# EAGLE design RECEPTRICE V16 (EAGLE 5.08)
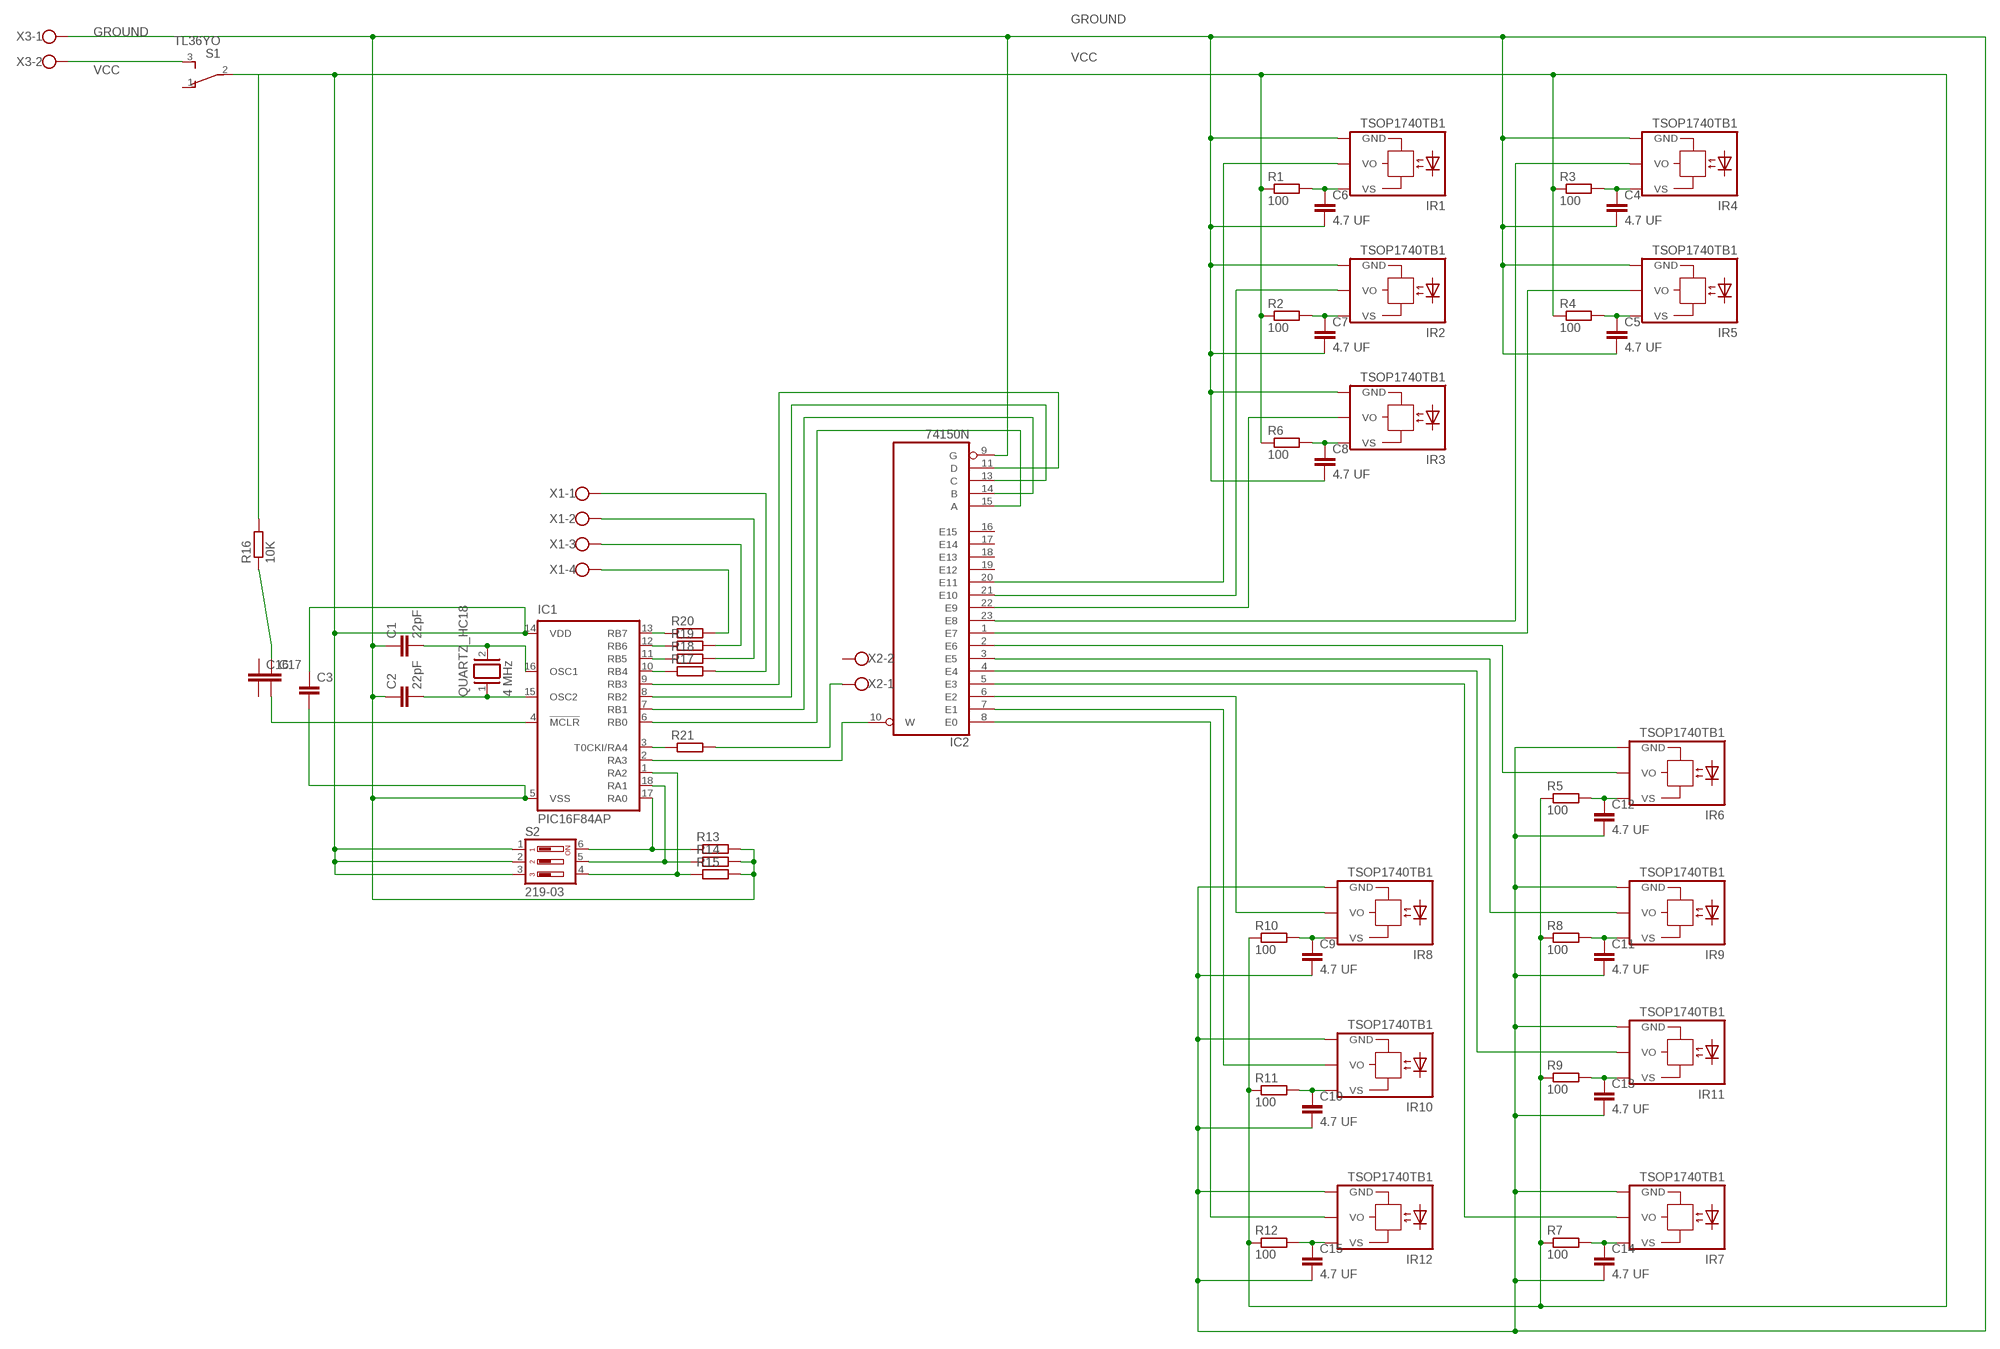
[diagram p0: schematic, sheet 1]

## Parts
C1  22pF  C2.5/5  [C2.5-5]
C2  22pF  C2.5/5  [C2.5-5]
C3  C2,5-3  [C2.5-3]
C4  4.7 UF  C5/3.5  [C5B3.5]
C5  4.7 UF  C5/3.5  [C5B3.5]
C6  4.7 UF  C5/3.5  [C5B3.5]
C7  4.7 UF  C5/3.5  [C5B3.5]
C8  4.7 UF  C5/3.5  [C5B3.5]
C9  4.7 UF  C5/3.5  [C5B3.5]
C10  4.7 UF  C5/3.5  [C5B3.5]
C11  4.7 UF  C5/3.5  [C5B3.5]
C12  4.7 UF  C5/3.5  [C5B3.5]
C13  4.7 UF  C5/3.5  [C5B3.5]
C14  4.7 UF  C5/3.5  [C5B3.5]
C15  4.7 UF  C5/3.5  [C5B3.5]
C16  C2,5-3  [C2.5-3]
C17  C2,5-3  [C2.5-3]
IC1  PIC16F84AP  [DIL18]
IC2  74150N  [DIL24-6]
IR1  TSOP1740TB1  [TSOP17_TB1]
IR2  TSOP1740TB1  [TSOP17_TB1]
IR3  TSOP1740TB1  [TSOP17_TB1]
IR4  TSOP1740TB1  [TSOP17_TB1]
IR5  TSOP1740TB1  [TSOP17_TB1]
IR6  TSOP1740TB1  [TSOP17_TB1]
IR7  TSOP1740TB1  [TSOP17_TB1]
IR8  TSOP1740TB1  [TSOP17_TB1]
IR9  TSOP1740TB1  [TSOP17_TB1]
IR10  TSOP1740TB1  [TSOP17_TB1]
IR11  TSOP1740TB1  [TSOP17_TB1]
IR12  TSOP1740TB1  [TSOP17_TB1]
QUARTZ_HC18  4 MHz  XTAL/S  [QS]
R1  100  R-EU_0207/5V  [0207/5V]
R2  100  R-EU_0207/5V  [0207/5V]
R3  100  R-EU_0207/5V  [0207/5V]
R4  100  R-EU_0207/5V  [0207/5V]
R5  100  R-EU_0207/5V  [0207/5V]
R6  100  R-EU_0207/5V  [0207/5V]
R7  100  R-EU_0207/5V  [0207/5V]
R8  100  R-EU_0207/5V  [0207/5V]
R9  100  R-EU_0207/5V  [0207/5V]
R10  100  R-EU_0207/5V  [0207/5V]
R11  100  R-EU_0207/5V  [0207/5V]
R12  100  R-EU_0207/5V  [0207/5V]
R13  R-EU_0207/5V  [0207/5V]
R14  R-EU_0207/5V  [0207/5V]
R15  R-EU_0207/5V  [0207/5V]
R16  10K  R-EU_0207/5V  [0207/5V]
R17  R-EU_0207/5V  [0207/5V]
R18  R-EU_0207/5V  [0207/5V]
R19  R-EU_0207/5V  [0207/5V]
R20  R-EU_0207/5V  [0207/5V]
R21  R-EU_0207/5V  [0207/5V]
S1  TL36YO  [TL3XYO]
S2  219-03  [CTS-219-03]
X1  W237-4  [W237-4]
X2  W237-102  [W237-102]
X3  W237-102  [W237-102]

## Nets
GROUND: C1.1 C2.1 C3.2 C4.2 C5.2 C6.2 C7.2 C8.2 C9.2 C10.2 C11.2 C12.2 C13.2 C14.2 C15.2 IC1.5(VSS) IC2.9(G) IR1.GND IR2.GND IR3.GND IR4.GND IR5.GND IR6.GND IR7.GND IR8.GND IR9.GND IR10.GND IR11.GND IR12.GND R13.2 R14.2 R15.2 X3.1
N$1: IC1.6(RB0) IC2.15(A)
N$2: IC1.7(RB1) IC2.14(B)
N$3: IC1.8(RB2) IC2.13(C)
N$4: IC1.9(RB3) IC2.11(D)
N$5: C6.1 IR1.VS R1.2
N$6: C4.1 IR4.VS R3.2
N$7: C7.1 IR2.VS R2.2
N$8: C5.1 IR5.VS R4.2
N$9: C12.1 IR6.VS R5.2
N$10: C8.1 IR3.VS R6.2
N$11: C14.1 IR7.VS R7.2
N$12: C9.1 IR8.VS R10.2
N$13: C11.1 IR9.VS R8.2
N$14: C13.1 IR11.VS R9.2
N$15: C10.1 IR10.VS R11.2
N$16: IC2.6(E2) IR8.VO
N$17: IC2.7(E1) IR10.VO
N$18: C15.1 IR12.VS R12.2
N$19: IC2.8(E0) IR12.VO
N$20: IC2.5(E3) IR7.VO
N$21: IC2.4(E4) IR11.VO
N$22: IC2.3(E5) IR9.VO
N$23: IC2.2(E6) IR6.VO
N$24: IC2.1(E7) IR5.VO
N$25: IC2.23(E8) IR4.VO
N$26: IC2.22(E9) IR3.VO
N$27: IC2.21(E10) IR2.VO
N$28: IC2.20(E11) IR1.VO
N$29: C2.2 IC1.15(OSC2) QUARTZ_HC18.1
N$30: C1.2 IC1.16(OSC1) QUARTZ_HC18.2
N$31: IC1.2(RA3) IC2.10(W)
N$32: C17.1 R16.1
N$33: IC1.17(RA0) R13.1 S2.6
N$34: IC1.18(RA1) R14.1 S2.5
N$36: IC1.1(RA2) R15.1 S2.4
N$37: C17.2 IC1.4(!MCLR)
N$38: S1.3(S) X3.2
N$39: R20.2 X1.4
N$40: IC1.13(RB7) R20.1
N$41: IC1.12(RB6) R19.1
N$42: IC1.11(RB5) R18.1
N$43: IC1.10(RB4) R17.1
N$44: R19.2 X1.3
N$45: R18.2 X1.2
N$46: R17.2 X1.1
N$48: IC1.3(T0CKI/RA4) R21.1
N$49: R21.2 X2.1
VCC: C3.1 IC1.14(VDD) R1.1 R2.1 R3.1 R4.1 R5.1 R6.1 R7.1 R8.1 R9.1 R10.1 R11.1 R12.1 R16.2 S1.2(P) S2.1 S2.2 S2.3
Unconnected: C16.1 C16.2 IC2.16(E15) IC2.17(E14) IC2.18(E13) IC2.19(E12) S1.1(O) X2.2

## Power pins joined to a net without a drawn wire
GND: IC2.12(GND)
VCC: IC2.24(VCC)

## Library data of the parts
C1-C17 = capacitor-wima:C: CAPACITOR naming: grid - package width
IC1 = microchip:PIC16F8*: MICROCONTROLLER 8-Bit PIC16F8X Family - CMOS Flash/EEPROM Pin Compatible : PIC16F83, PIC16CR83, PIC16F84A, PIC16CR84 see also PIC16C*
IC2 = 74xx-eu:74*150: Data SELCTOR/MULTIPLEXER
IR1-IR12 = telefunken:TSOP17*TB1: TSOP17..TB1 IR Receiver Modules for Remote Control Systems Source: http://www.vishay.com/docs/82042/82042.pdf
QUARTZ_HC18 = special:XTAL/S: CRYSTAL
R1-R21 = resistor:R-EU_: RESISTOR, European symbol
S1 = switch:TL36YO: TINY SWITCH ON - ON Source: http://www2.produktinfo.conrad.com/datenblaetter/700000-724999/705152-da-01-de-Subminiaturschalter_TL_36YO.pdf
S2 = switch-dil:219-03*: Surface Mount DIP Switch Series 219 SMT CTS Electronic Components Sourc: www.ctscorp.com
X1 = con-wago-500:W237-4: WAGO SCREW CLAMP
X2 X3 = con-wago-500:W237-102: WAGO SCREW CLAMP

## Board
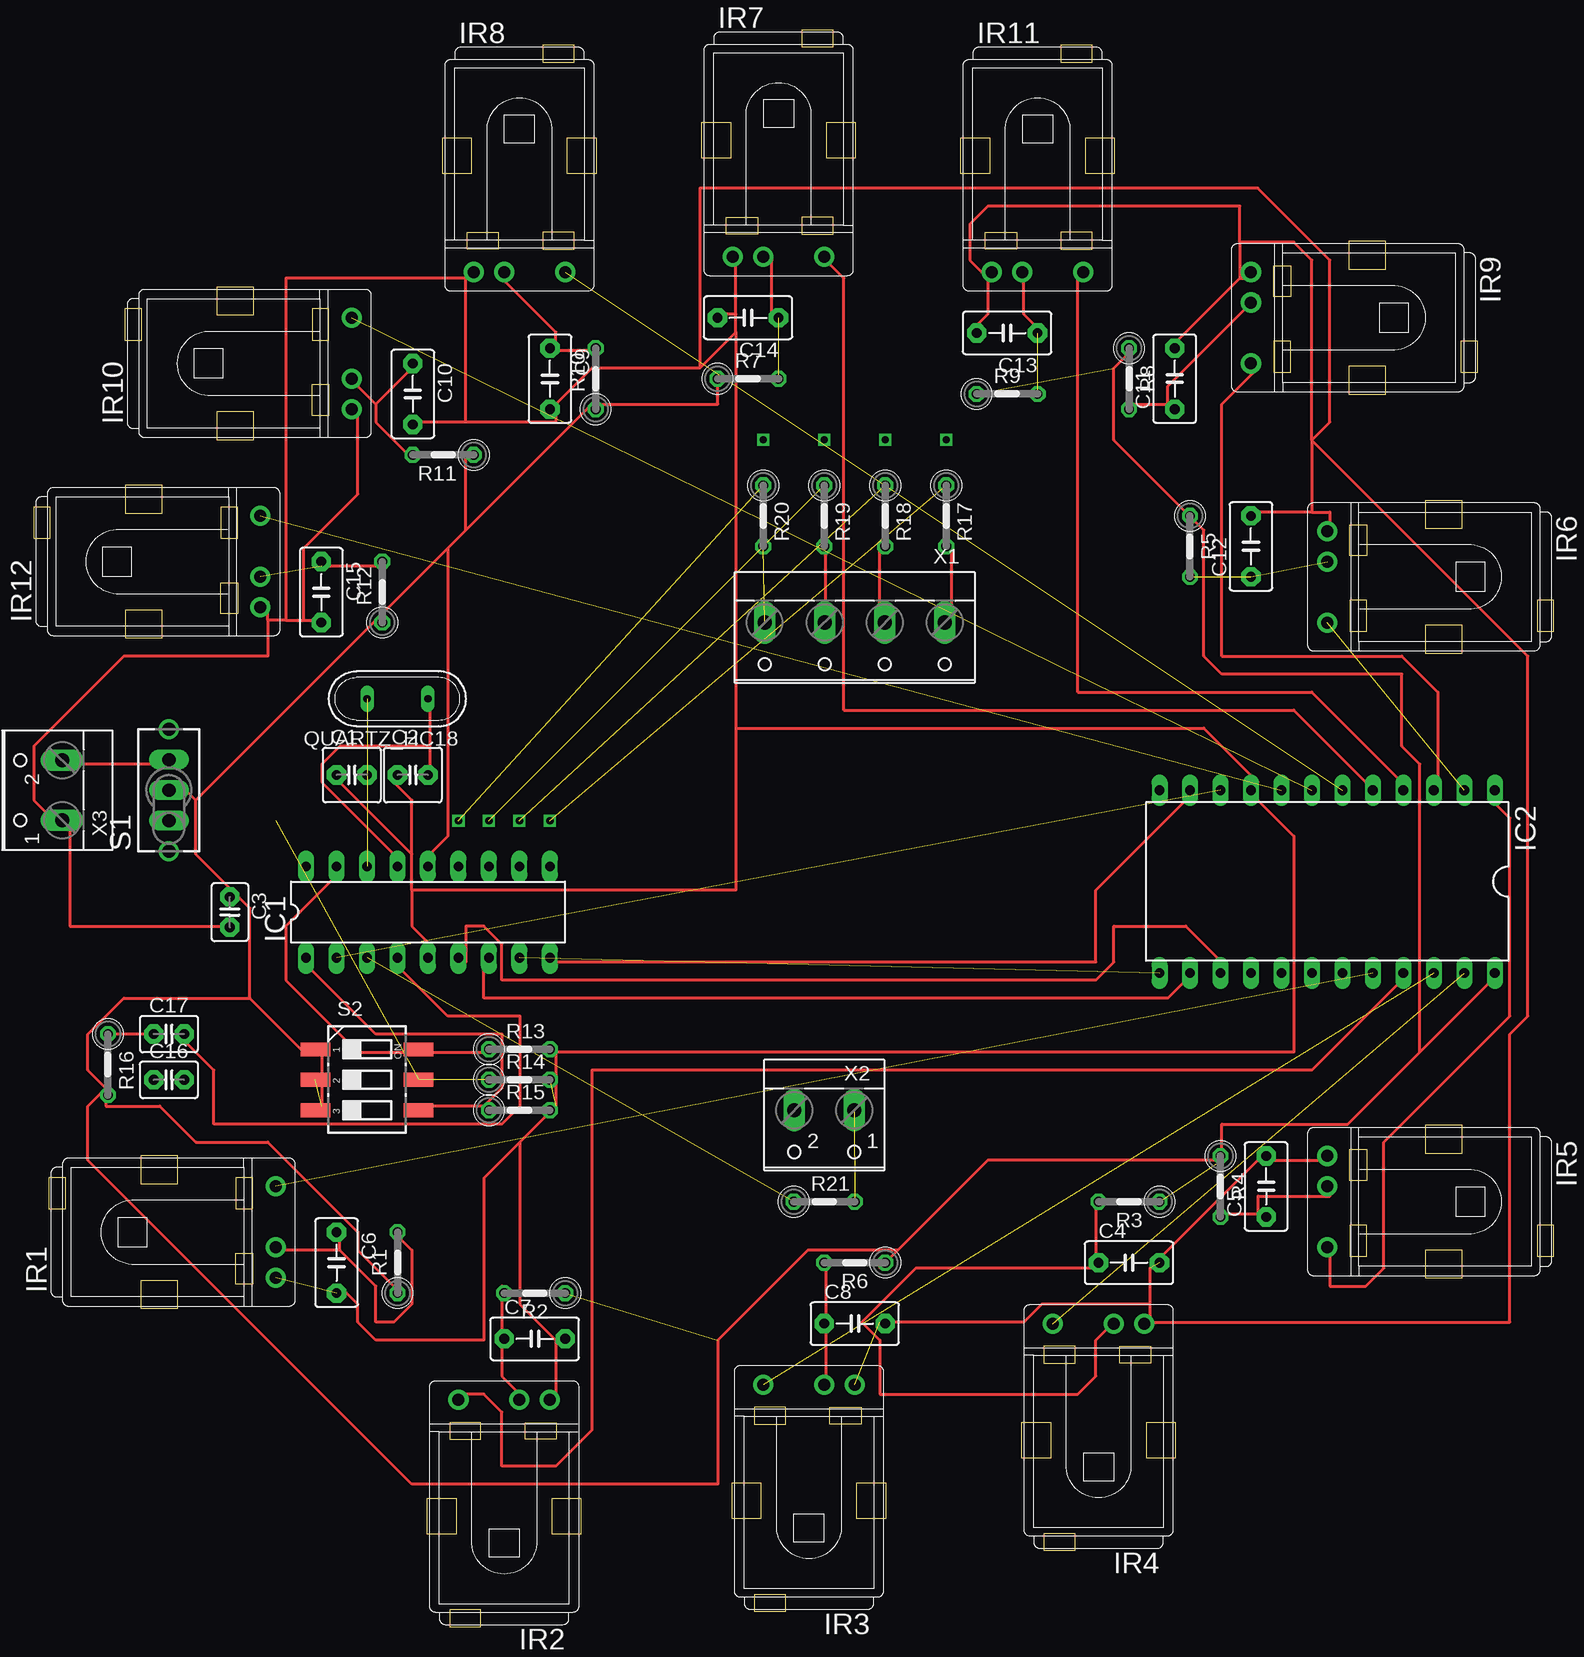
[diagram p1: board, top side]
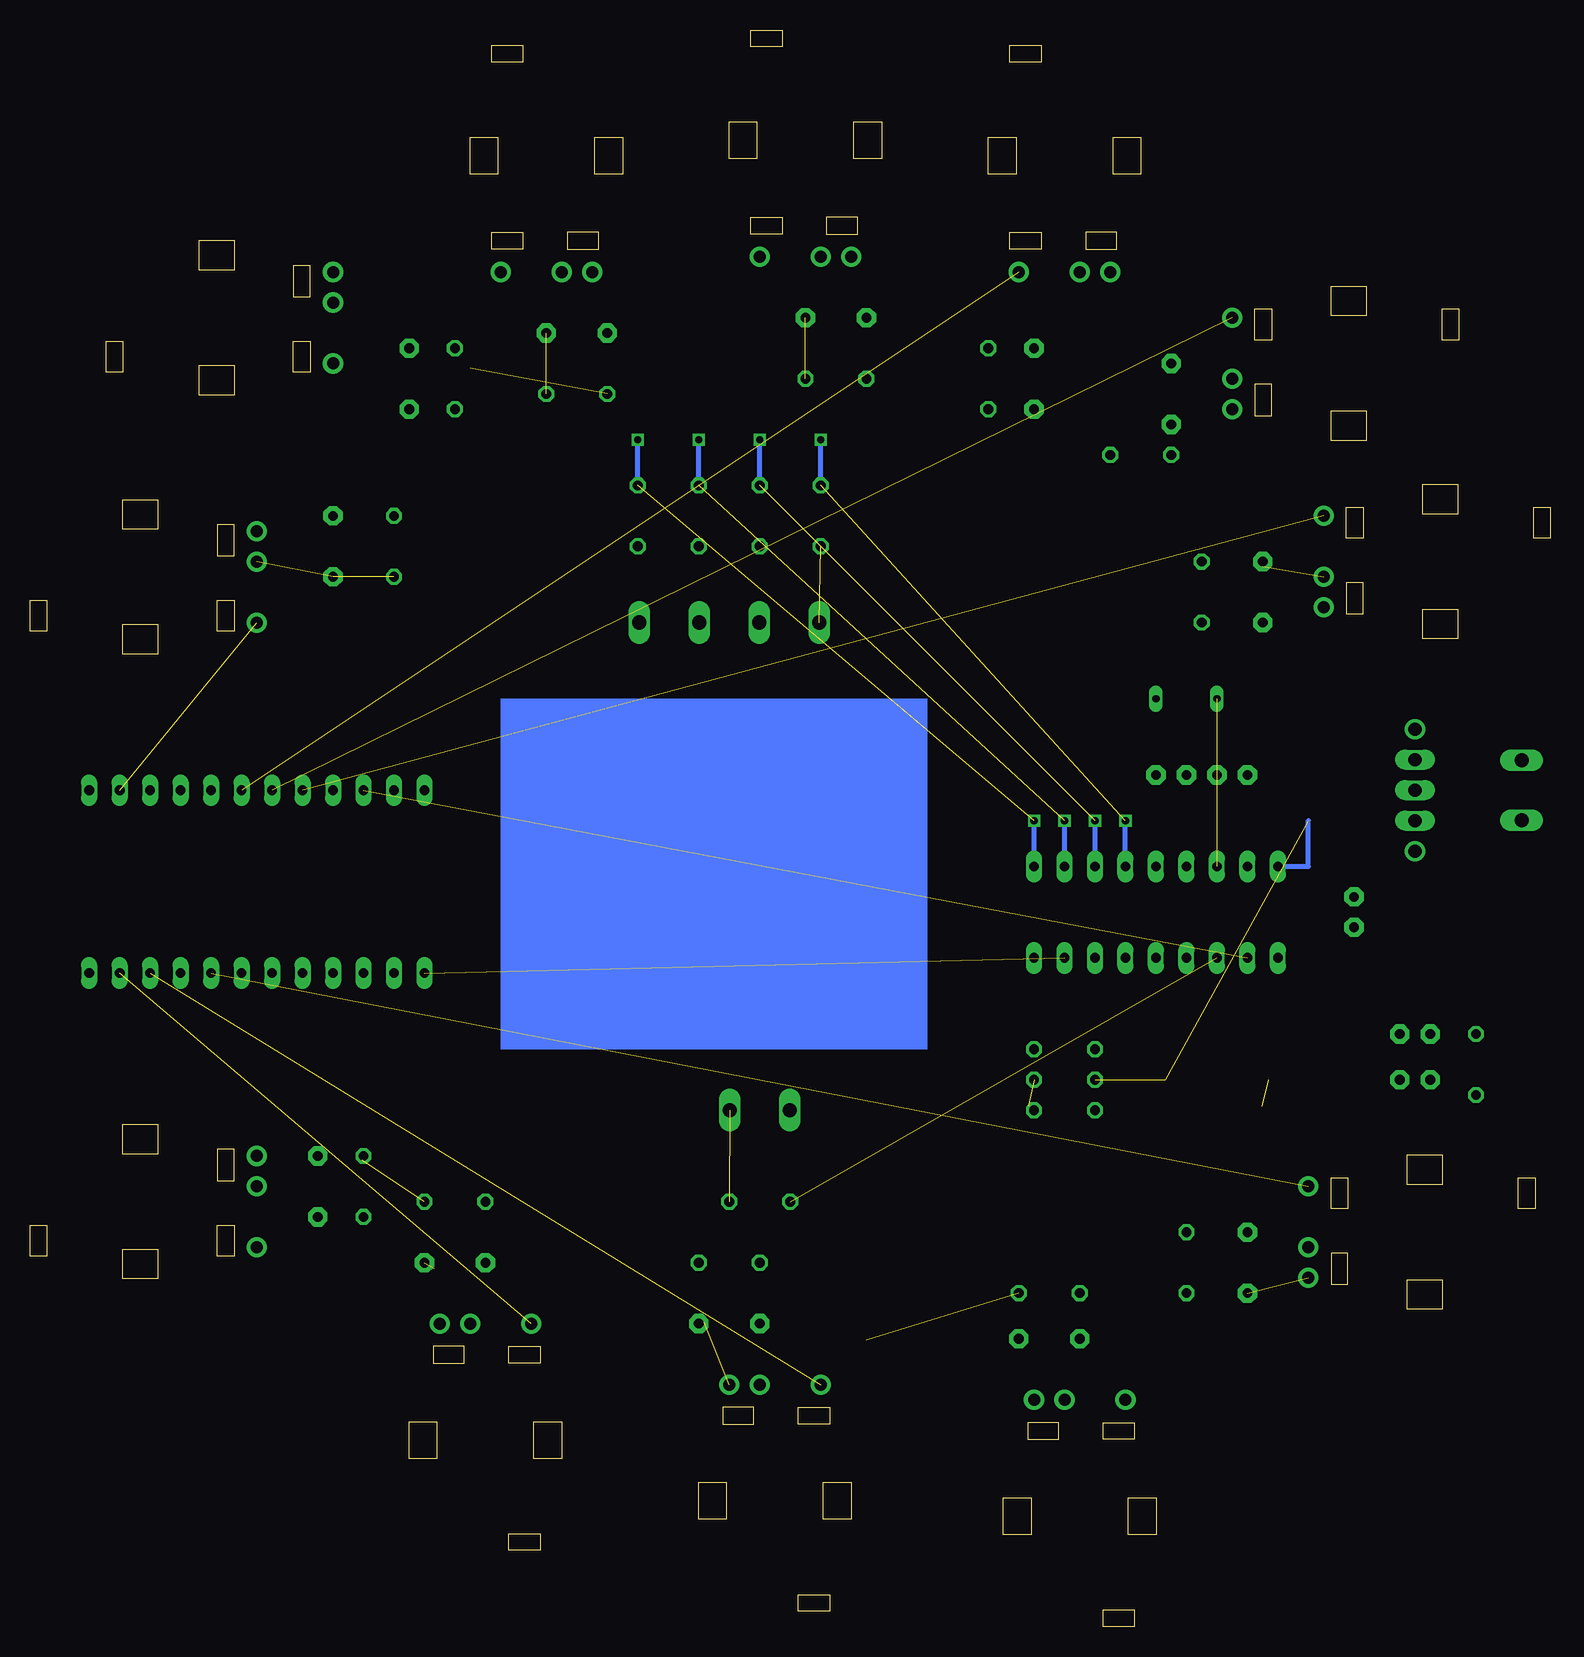
[diagram p2: board, bottom side, seen from below]

Size 126.7 x 133.05 mm. Coordinates in mm from the lower left corner, seen from the top.
Copper layers (1*16): Top 0.035mm / dielectric 1.5mm / Bottom 0.035mm
Design rules "default": minimum track width 10mil, minimum drill 24mil, track to track 8mil, track to pad 8mil, pad to pad 8mil, via to via 8mil, smd to smd 8mil, copper to edge 40mil, drill to drill 8mil, minimum pad ring 10mil, minimum via ring 8mil, stop-mask expansion 4mil, vias tented up to drill 0mil, thermal gap 10mil

### Footprints (pad centres in the part's own frame; a part is rotated, then mirrored left to right if it is on the bottom)
C2.5-5 = drill 0.813 pad 1.6 octagon: 1 -1.27,0; 2 1.27,0
C2.5-3 = drill 0.813 pad 1.6 octagon: 1 -1.27,0; 2 1.27,0
C5B3.5 = drill 0.813 pad 1.6 octagon: 1 -2.54,0; 2 2.54,0
DIL18 = drill 0.813 long: 1 -10.16,-3.81; 2 -7.62,-3.81; 3 -5.08,-3.81; 4 -2.54,-3.81; 5 0,-3.81; 6 2.54,-3.81; 7 5.08,-3.81; 8 7.62,-3.81; 9 10.16,-3.81; 10 10.16,3.81; 11 7.62,3.81; 12 5.08,3.81; 13 2.54,3.81; 14 0,3.81; 15 -2.54,3.81; 16 -5.08,3.81; 17 -7.62,3.81; 18 -10.16,3.81
DIL24-6 = drill 0.813 long: 1 -13.97,-7.62; 2 -11.43,-7.62; 3 -8.89,-7.62; 4 -6.35,-7.62; 5 -3.81,-7.62; 6 -1.27,-7.62; 7 1.27,-7.62; 8 3.81,-7.62; 9 6.35,-7.62; 10 8.89,-7.62; 11 11.43,-7.62; 12 13.97,-7.62; 13 13.97,7.62; 14 11.43,7.62; 15 8.89,7.62; 16 6.35,7.62; 17 3.81,7.62; 18 1.27,7.62; 19 -1.27,7.62; 20 -3.81,7.62; 21 -6.35,7.62; 22 -8.89,7.62; 23 -11.43,7.62; 24 -13.97,7.62
TSOP17_TB1 = drill 1 pad 1.676 round: GND 0,-3.81; VO 0,3.81; VS 0,-1.27
QS = drill 0.61 long: 1 -2.54,0; 2 2.54,0
0207/5V = drill 0.813 octagon: 1 -2.54,0; 2 2.54,0
TL3XYO = drill 1.1 pad 1.422 long: 1 -2.54,0; 2 0,0; 3 2.54,0 | drill 1.1 pad 1.676 round: M1 -5.08,0; M2 5.08,0
CTS-219-03 = smd 1.13 x 2.44: 1 -2.54,-4.3; 2 0,-4.3; 3 2.54,-4.3; 4 2.54,4.3; 5 0,4.3; 6 -2.54,4.3
W237-4 = drill 1.194 long: 1 -7.5,-1.27; 2 -2.5,-1.27; 3 2.5,-1.27; 4 7.5,-1.27
W237-102 = drill 1.194 long: 1 -2.5,-1.27; 2 2.5,-1.27

### Placement (x,y rotation side)
C1  26.52,70.97 0 top
C2  31.6,70.97 0 top
C3  16.36,59.54 270 top
C4  91.29,30.33 0 top
C5  102.72,36.68 90 top
C6  25.25,30.33 270 top
C7  41.76,23.98 0 top
C8  68.43,25.25 0 top
C9  43.03,103.99 270 top
C10  31.6,102.72 270 top
C11  95.1,103.99 90 top
C12  101.45,90.02 90 top
C13  81.13,107.8 180 top
C14  59.54,109.07 180 top
C15  23.98,86.21 270 top
C16  11.28,45.57 0 top
C17  11.28,49.38 0 top
IC1  32.87,59.54 0 top
IC2  107.8,62.08 180 top
IR1  20.17,32.87 0 top
IR2  39.22,18.9 90 top
IR3  64.62,20.17 90 top
IR4  88.75,25.25 90 top
IR5  107.8,35.41 180 top
IR6  107.8,87.48 180 top
IR7  62.08,114.15 270 top
IR8  40.49,112.88 270 top
IR9  101.45,109.07 180 top
IR10  26.52,105.26 0 top
IR11  83.67,112.88 270 top
IR12  18.9,88.75 0 top
QUARTZ_HC18  30.33,77.32 180 top
R1  30.33,30.33 90 top
R2  41.76,27.79 180 top
R3  91.29,35.41 180 top
R4  98.91,36.68 270 top
R5  96.37,90.02 270 top
R6  68.43,30.33 180 top
R7  59.54,103.99 0 top
R8  91.29,103.99 270 top
R9  81.13,102.72 0 top
R10  46.84,103.99 90 top
R11  34.14,97.64 180 top
R12  29.06,86.21 90 top
R13  40.49,48.11 0 top
R14  40.49,45.57 0 top
R15  40.49,43.03 0 top
R16  6.2,46.84 270 top
R17  76.05,92.56 270 top
R18  70.97,92.56 270 top
R19  65.89,92.56 270 top
R20  60.81,92.56 270 top
R21  65.89,35.41 0 top
S1  11.28,69.7 90 top
S2  27.79,45.57 270 top
X1  68.43,82.4 180 top
X2  65.89,41.76 180 top
X3  1.12,69.7 90 top

### Tracks (layer width: path | path; a pad name or v marks a point on that pad's centre or on a via)
GROUND  (4 unrouted)
  Top 0.254: 102.03,38.87 108.03,38.87 IR5.GND | 93.03,26.87 84.03,26.87 82.53,25.37 70.53,25.37 C8.2 | 93.03,26.87 93.03,25.37 | 102.03,38.87 93.03,29.87 93.03,26.87 | C5.2 102.03,38.87 | 106.53,92.87 108.03,92.87 108.03,91.37 IR6.GND | 106.53,92.87 102.03,92.87 C12.2 | 79.53,112.37 79.53,109.37 78.03,107.87 C13.2 | 100.53,112.37 94.53,106.37 C11.2 | 100.53,112.37 102.03,112.37 IR9.GND | 79.53,112.37 78.03,113.87 78.03,116.87 79.53,118.37 100.53,118.37 100.53,115.37 | 100.53,115.37 100.53,112.37 | 79.53,112.37 IR11.GND | 106.53,98.87 106.53,113.87 105.03,115.37 100.53,115.37 | 106.53,98.87 106.53,92.87 | 93.03,25.37 123.03,25.37 123.03,49.37 124.53,50.87 124.53,80.87 106.53,98.87 | 93.03,25.37 IR4.GND | 36.03,100.37 43.53,100.37 43.53,101.87 | 36.03,100.37 31.53,100.37 C10.2 | 36.03,100.37 36.03,112.37 | C3.2 16.53,58.37 3.03,58.37 3.03,67.37 X3.1 1.53,67.37 0.03,68.87 0.03,73.37 7.53,80.87 19.53,80.87 19.53,83.87 | 21.03,83.87 19.53,83.87 | 21.03,83.87 22.53,83.87 | 22.53,83.87 24.03,83.87 C15.2 | 19.53,83.87 19.53,85.37 IR12.GND | 22.53,83.87 22.53,89.87 27.03,94.37 27.03,101.87 IR10.GND | 36.03,112.37 21.03,112.37 21.03,83.87 | 36.03,112.37 IR8.GND | 43.53,23.87 43.53,19.37 IR2.GND | 43.53,47.87 43.53,43.37 | 43.53,43.37 40.53,40.37 | 40.53,40.37 37.53,37.37 37.53,23.87 28.53,23.87 27.03,25.37 27.03,26.87 25.53,28.37 C6.2 | 43.53,43.37 R15.2 | 43.53,23.87 40.53,26.87 40.53,40.37 | 43.53,23.87 C7.2 | 31.53,64.37 31.53,68.87 30.03,70.37 C2.1 | 31.53,61.37 31.53,64.37 | 31.53,61.37 31.53,58.37 33.03,56.87 IC1.5 | 31.53,64.37 25.53,70.37 C1.1 | 58.53,74.87 97.53,74.87 102.03,70.37 IC2.9 102.03,68.87 105.03,65.87 105.03,47.87 43.53,47.87
  Top 0.254: 58.53,109.37 58.53,113.87 IR7.GND | 58.53,107.87 58.53,109.37 | 58.53,107.87 58.53,74.87 | 58.53,109.37 57.03,109.37 C14.2 | 31.53,61.37 58.53,61.37 58.53,74.87 | 43.53,47.87 R13.2 | 43.53,101.87 46.53,104.87 55.53,104.87 | 55.53,104.87 58.53,107.87 | 43.53,101.87 C9.2 | 106.53,98.87 108.03,100.37 108.03,113.87 102.03,119.87 55.53,119.87 55.53,104.87
N$1
  Top 0.254: IC2.15 99.03,55.37 96.03,58.37 90.03,58.37 90.03,55.37 88.53,53.87 39.03,53.87 39.03,56.87 37.53,58.37 36.03,58.37 36.03,55.37 IC1.6
N$2
  Top 0.254: IC2.14 96.03,53.87 94.53,52.37 37.53,52.37 37.53,55.37 IC1.7
N$3  (1 unrouted)
N$4
  Top 0.254: IC1.9 43.53,55.37 88.53,55.37 88.53,61.37 96.03,68.87 IC2.11
N$5
  Top 0.254: 25.53,31.37 28.53,28.37 28.53,25.37 30.03,25.37 31.53,26.87 31.53,31.37 30.03,32.87 R1.2 | 25.53,31.37 25.53,32.87 C6.1 | 25.53,31.37 19.53,31.37 IR1.VS
N$6
  Top 0.254: 88.53,29.87 88.53,35.87 R3.2 | 88.53,29.87 73.53,29.87 69.03,25.37 70.53,23.87 70.53,19.37 87.03,19.37 88.53,20.87 88.53,23.87 90.03,25.37 IR4.VS | 88.53,29.87 C4.1
N$7
  Top 0.254: 39.03,23.87 39.03,28.37 R2.2 | 39.03,23.87 39.03,20.87 40.53,19.37 IR2.VS | 39.03,23.87 C7.1
N$8
  Top 0.254: 102.03,34.37 99.03,34.37 R4.2 | 102.03,34.37 102.03,35.87 108.03,35.87 IR5.VS | 102.03,34.37 C5.1
N$9  (2 unrouted)
N$10
  Top 0.254: 66.03,25.37 66.03,29.87 R6.2 | 66.03,25.37 66.03,20.87 IR3.VS | 66.03,25.37 C8.1
N$11  (1 unrouted)
  Top 0.254: C14.1 61.53,109.37 61.53,113.87 IR7.VS
N$12
  Top 0.254: 43.53,106.37 46.53,106.37 R10.2 | 43.53,106.37 43.53,107.87 39.03,112.37 IR8.VS | C9.1 43.53,106.37
N$13
  Top 0.254: 94.53,101.87 91.53,101.87 R8.2 | 94.53,101.87 94.53,103.37 102.03,110.87 IR9.VS | 94.53,101.87 C11.1
N$14  (1 unrouted)
  Top 0.254: C13.1 84.03,107.87 82.53,109.37 82.53,112.37 IR11.VS
N$15
  Top 0.254: 28.53,101.87 28.53,100.37 31.53,97.37 R11.2 | 28.53,101.87 27.03,103.37 IR10.VS | 28.53,101.87 31.53,104.87 C10.1
N$16  (1 unrouted)
N$17  (1 unrouted)
N$18  (1 unrouted)
  Top 0.254: R12.2 28.53,88.37 24.03,88.37 C15.1
N$19  (1 unrouted)
N$20
  Top 0.254: IC2.5 111.03,70.37 105.03,76.37 67.53,76.37 67.53,112.37 66.03,113.87 IR7.VO
N$21
  Top 0.254: IC2.4 114.03,70.37 106.53,77.87 87.03,77.87 87.03,112.37 IR11.VO
N$22
  Top 0.254: IC2.3 117.03,70.37 117.03,77.87 114.03,80.87 99.03,80.87 99.03,101.87 102.03,104.87 IR9.VO
N$23  (1 unrouted)
N$24
  Top 0.254: IC2.1 121.53,68.87 123.03,67.37 123.03,50.87 112.53,40.37 112.53,29.87 111.03,28.37 108.03,28.37 108.03,31.37 IR5.VO
N$25  (1 unrouted)
N$26  (1 unrouted)
N$27
  Top 0.254: IC2.21 114.03,53.87 106.53,46.37 46.53,46.37 46.53,16.37 43.53,13.37 39.03,13.37 39.03,17.87 37.53,19.37 36.03,19.37 IR2.VO
N$28  (1 unrouted)
N$29
  Top 0.254: 33.03,73.37 33.03,70.37 C2.2 | 33.03,73.37 33.03,76.37 QUARTZ_HC18.1 | 33.03,73.37 25.53,73.37 24.03,71.87 24.03,70.37 30.03,64.37 IC1.15
N$30  (2 unrouted)
N$31  (1 unrouted)
N$32
  Top 0.254: R16.1 6.03,49.37 10.53,49.37 C17.1
N$33
  Top 0.254: R13.1 37.53,47.87 33.03,47.87 S2.6 31.53,47.87 27.03,47.87 21.03,53.87 21.03,58.37 25.53,62.87 IC1.17
N$34  (2 unrouted)
  Bottom 0.406: IC1.18 20.17,63.35 20.17,67.16
N$36
  Top 0.254: 37.53,43.37 33.03,43.37 S2.4 | 37.53,43.37 39.03,44.87 39.03,49.37 28.53,49.37 22.53,55.37 IC1.1 | 37.53,43.37 R15.1
N$37
  Top 0.254: IC1.4 30.03,55.37 34.53,50.87 40.53,50.87 40.53,43.37 39.03,41.87 15.03,41.87 15.03,46.37 12.03,49.37 C17.2
N$38
  Top 0.254: S1.3 10.53,71.87 3.03,71.87 X3.2
N$39  (1 unrouted)
N$40  (via drill 0.6)  (1 unrouted)
  Bottom 0.406: R20.1 v60.81,98.91 | IC1.13 v35.41,67.16
N$41  (via drill 0.6)  (1 unrouted)
  Bottom 0.406: R19.1 v65.89,98.91 | IC1.12 v37.95,67.16
N$42  (via drill 0.6)  (1 unrouted)
  Bottom 0.406: R18.1 v70.97,98.91 | IC1.11 v40.49,67.16
N$43  (via drill 0.6)  (1 unrouted)
  Bottom 0.406: R17.1 v76.05,98.91 | IC1.10 v43.03,67.16
N$44
  Top 0.254: R19.2 66.03,89.87 66.03,83.87 X1.3
N$45
  Top 0.254: R18.2 70.53,89.87 70.53,83.87 X1.2
N$46
  Top 0.254: R17.2 76.53,89.87 76.53,83.87 X1.1
N$48  (1 unrouted)
N$49  (1 unrouted)
VCC  (4 unrouted)
  Top 0.254: 6.03,44.87 6.03,43.37 10.53,43.37 13.53,40.37 19.53,40.37 27.03,32.87 27.03,31.37 30.03,28.37 R1.1 | S2.3 24.03,43.37 24.03,47.87 S2.1 22.53,47.87 18.03,52.37 | 16.53,61.37 13.53,64.37 13.53,68.87 | 13.53,68.87 12.03,70.37 S1.2 | 18.03,52.37 18.03,59.87 16.53,61.37 | 16.53,61.37 C3.1 | 46.53,101.87 57.03,101.87 57.03,103.37 R7.1 | 34.53,89.87 36.03,91.37 | 28.53,83.87 34.53,89.87 | 36.03,91.37 36.03,97.37 R11.1 | 34.53,89.87 34.53,65.87 33.03,64.37 IC1.14 | 36.03,91.37 46.53,101.87 | 46.53,101.87 R10.1 | 13.53,68.87 28.53,83.87 | 28.53,83.87 R12.1 | 6.03,44.87 4.53,46.37 4.53,49.37 7.53,52.37 18.03,52.37 | 96.03,92.87 90.03,98.87 90.03,104.87 91.53,106.37 R8.1 | 72.03,31.37 79.53,38.87 99.03,38.87 | 72.03,31.37 70.53,29.87 R6.1 | 115.53,47.87 109.53,41.87 99.03,41.87 99.03,38.87 | 115.53,47.87 121.53,53.87 IC2.24 | 99.03,38.87 R4.1 | 96.03,92.87 97.53,91.37 97.53,80.87 99.03,79.37 114.03,79.37 114.03,73.37 115.53,71.87 115.53,47.87 | 96.03,92.87 R5.1 | 6.03,44.87 4.53,43.37 4.53,38.87 31.53,11.87 57.03,11.87 57.03,23.87 64.53,31.37 72.03,31.37 | 6.03,44.87 R16.2
(copper drawn outside any net)
  shapes: Bottom area x2